# Altium schematic sheet digital-analog-sensor.SchDoc
size A
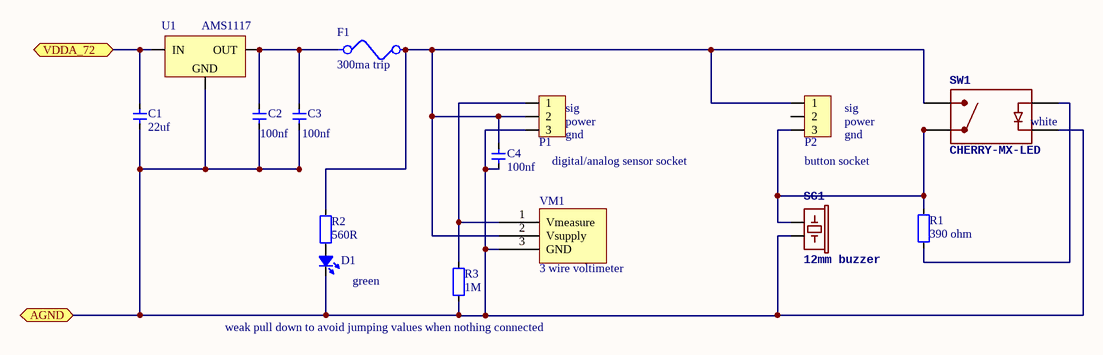
[diagram p0: digital-analog-sensor.SchDoc]

## Parts
C1  value 22uf  [CAP_0805]  (hidden comment: Cap_0805)
C2  value 100nf  [CAP_0805]  (hidden comment: Cap_0805)
C3  value 100nf  [CAP_0805]  (hidden comment: Cap_0805)
C4  value 100nf  [CAP_0805]  (hidden comment: Cap_0805)
D1  LED_0805  [LED_0805_RED]  (value not drawn)
F1  300ma trip  [Multifuse1812]
P1  HDR1x3_2.54  [HDR1X3_2.54_180]  (value not drawn)
P2  HDR1x3_2.54  [HDR1X3_2.54_180]  (value not drawn)
R1  value 390 ohm  [RES_0805]  (hidden comment: Res_0805)
R2  value 560R  [RES_0805]  (hidden comment: Res_0805)
R3  weak pull down to avoid jumping values when nothing connected  value 1M  [RES_0805]
SG1  12mm buzzer  [BUZZER-12MM]
SW1  CHERRY-MX-LED  [MX-LED]
U1  AMS1117  [SOT223-3-CONNECTEDTAB]
VM1  3 wire voltimeter  [led_meter_0.36]

## Ports
AGND, VDDA_72

## Nets
AGND: C1.1 C2.1 C3.1 C4.1 D1.2(K) P1.3 R3.1 SG1.- SW1.P$3 U1.1(GND) VM1.3(GND) ; port AGND
VDDA_72: C1.2 U1.3(IN) ; port VDDA_72
NetC2_2: C2.2 C3.2 F1.2 U1.2(OUT)
NetC4_2: C4.2 F1.1 P1.2 P2.1 R2.2 SW1.P$2 VM1.2(Vsupply)
NetD1_1: D1.1(A) R2.1
NetP1_1: P1.1 R3.2 VM1.1(Vmeasure)
NetP2_3: P2.3 R1.2 SG1.+ SW1.P$1
NetR1_1: R1.1 SW1.P$4

Not connected (* = marked no-connect by the designer): P2 2

## Notes on the sheet
- (near P1) digital/analog sensor socket
- (near P1) sig
- (near P1) power
- (near P1) gnd
- (near P2) button socket
- (near P2) sig
- (near P2) power
- (near P2) gnd
- (near SW1) white
- green

## Library data of the parts
C1-C4 = Cap_0805: Capacitor
D1 = LED_0805: LED
F1 = Multifuse: RO ZEK MULTI 500MA SMD 1812 MF-MSMF050-2 BOURNS; ID: Library_FUSE-0001; Faber ItemCode: 35502800; Info: MULTIFUSE, SMD, 0.5A; Value: 0.5A; Mfg: BOURNS; Mfg code: MF-MSMF050-2
P1 P2 = HDR1x3_2.54: Header
R1-R3 = Res_0805: Resistor
SG1 = BUZZERPTH
U1 = AMS1117: Power
VM1 = Voltmeter_LED_3wire